# Altium schematic sheet Microcontroller_IO.SchDoc: Microcontroller_IO
size A; DrawnBy: FitC Engineers; Revision: 1; SheetNumber: 5; SheetTotal: 5
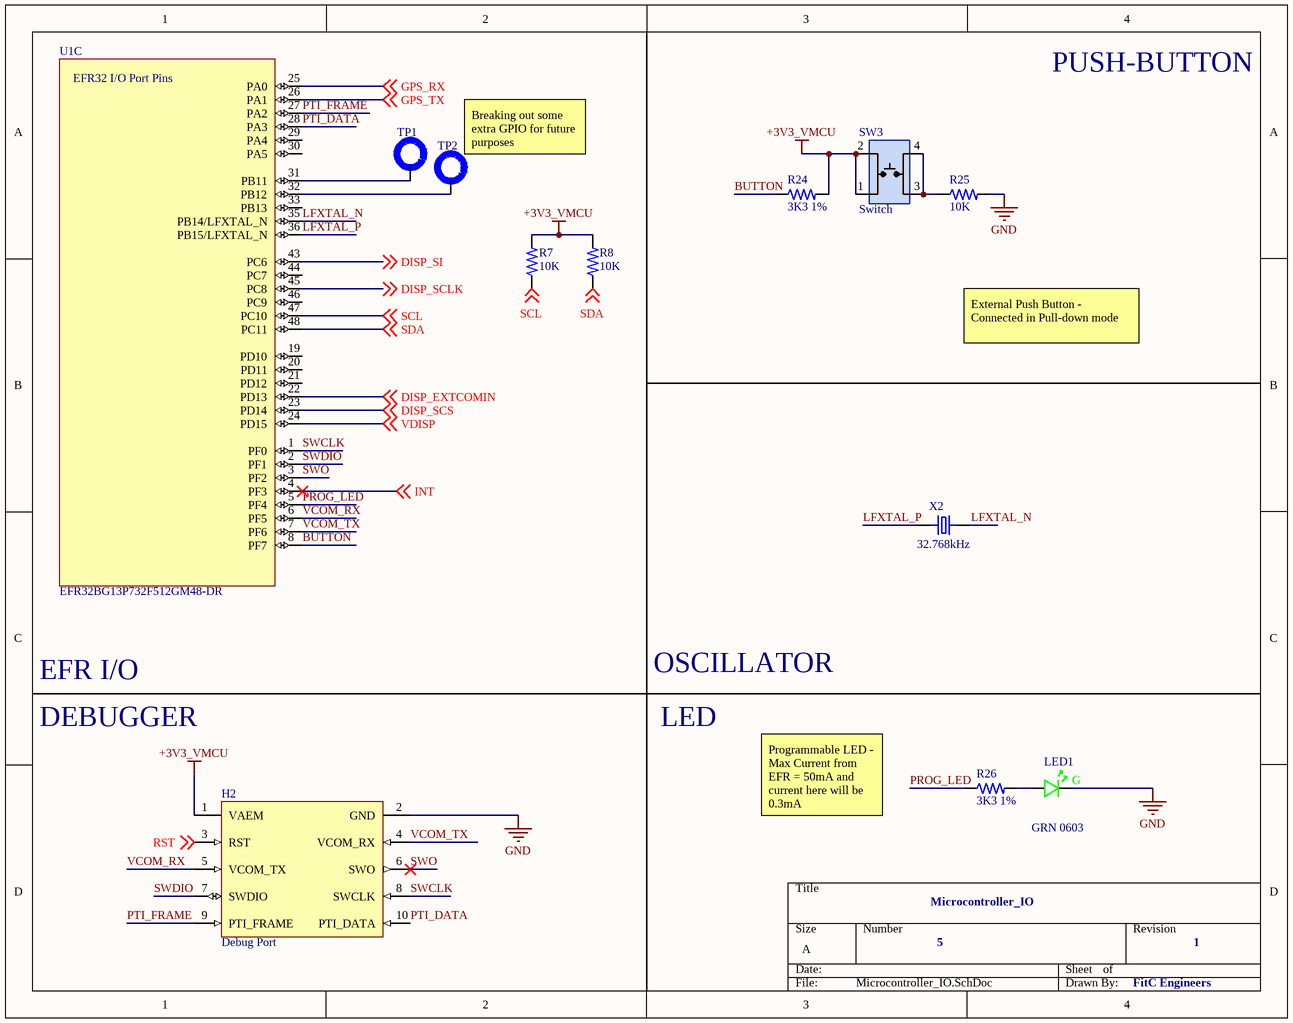
[diagram p0: Microcontroller_IO.SchDoc]

## Parts
H2  Debug Port  [Amphenol_20021121_0]
LED1  GRN 0603  [LED_0603_GRN_WL-SMCW]
R7  10K  [RES_0603_1608X06]
R8  10K  [RES_0603_1608X06]
R24  3K3 1%  [RES_0603_1608X06]
R25  10K  [RES_0603_1608X06]
R26  3K3 1%  [RES_0603_1608X06]
SW3  Switch  [SWITCH]
TP1  Test Pad for Testing  [1mm Test Pad]  (value not drawn)  (no BOM)
TP2  Test Pad for Testing  [1mm Test Pad]  (value not drawn)  (no BOM)
U1  EFR32BG13P732F512GM48-DR  [EFR32BG13_48_QFN]  (part C of 3)
X2  32.768kHz  [XTAL_ECS-.327-7-34B-TR]

## Nets
+3V3_VMCU: H2.1(VAEM) R7.2 R8.2 R24.2 SW3.1 SW3.2
GND: H2.2(GND) LED1.C R25.2
BUTTON: R24.1 U1.8(PF7)
DISP_EXTCOMIN: U1.22(PD13) ; off-sheet DISP_EXTCOMIN
DISP_SCLK: U1.45(PC8) ; off-sheet DISP_SCLK
DISP_SCS: U1.23(PD14) ; off-sheet DISP_SCS
DISP_SI: U1.43(PC6) ; off-sheet DISP_SI
GPS_RX: U1.25(PA0) ; off-sheet GPS_RX
GPS_TX: U1.26(PA1) ; off-sheet GPS_TX
INT: U1.4(PF3) ; off-sheet INT
LFXTAL_N: U1.35(PB14/LFXTAL_N) X2.2
LFXTAL_P: U1.36(PB15/LFXTAL_N) X2.1
PROG_LED: R26.1 U1.5(PF4)
PTI_DATA: H2.10(PTI_DATA) U1.28(PA3)
PTI_FRAME: H2.9(PTI_FRAME) U1.27(PA2)
RST: H2.3(RST) ; off-sheet RST
SCL: R7.1 U1.47(PC10) ; off-sheet SCL
SDA: R8.1 U1.48(PC11) ; off-sheet SDA
SWCLK: H2.8(SWCLK) U1.1(PF0)
SWDIO: H2.7(SWDIO) U1.2(PF1)
SWO: H2.6(SWO) U1.3(PF2)
VCOM_RX: H2.5(VCOM_TX) U1.6(PF5)
VCOM_TX: H2.4(VCOM_RX) U1.7(PF6)
VDISP: U1.24(PD15) ; off-sheet VDISP
NetLED1_A: LED1.A R26.2
NetR25_1: R25.1 SW3.3 SW3.4
NetTP1_1: TP1.1 U1.31(PB11)
NetTP2_1: TP2.1 U1.32(PB12)

Not connected (* = marked no-connect by the designer): U1 19(PD10) 20(PD11) 21(PD12) 29(PA4) 30(PA5) 33(PB13) 44(PC7) 46(PC9)

## Notes on the sheet
- PUSH-BUTTON
- (near TP2) Breaking out some extra GPIO for future purposes
- External Push Button - Connected in Pull-down mode
- EFR I/O
- OSCILLATOR
- DEBUGGER
- LED
- Programmable LED - Max Current from EFR = 50mA and current here will be 0.3mA
- (in symbol 150060GS75000) G
- (in symbol EFR32BG13P732F512GM48-DR, part C) EFR32 I/O Port Pins

## Library data of the parts
H2 = 20021121-00010C1LF: CONN HEADER SMD 10POS 1.27MM. Connector Header Surface Mount 10 position 0.050"; Manufacturer: Amphenol ICC / FCI; Supplier 1: Digi-Key; Manufacturer Part Number: 20021121-00010C1LF; RoHS: No; Category: Headers and Wire Housings
LED1 = 150060GS75000: LED, 0603, GREEN, 430MCD, 520NM; Manufacturer: Wurth Electronics; Dynamic Catalog: 0603 Rectangle with Flat Top Chip LEDs; 3D Model: SMCW_0603.igs / SMCW_0603.stp / SMCW_0603.wrl; Wavelength - Peak: 515nm; Voltage - Forward (Vf) (Typ): 3.2V; Current - Test: 20mA; Viewing Angle: 140°; Lens Type: Clear; Lens Style/Size: Rectangle with Flat Top, 1.1mm x 0.7mm; Other Names: 732-4971-2; Supplier 1: Digi-Key; Manufacturer Part Number: 150060GS75000; Stock 1: 34964; Pricing 1: 1=0.14, 50=0.129, 100=0.11, 500=0.095 (USD); Standard Package: 4,000; Category: Optoelectronics; Family: LED Indication - Discrete; Series: WL-SMCW; Packaging: Tape & Reel (TR); Color: Green; Wavelength - Dominant: 520nm; Millicandela Rating: 430mcd; Package / Case: 0603 (1608 Metric); Size / Dimension: 1.60mm L x 0.80mm W; Height: 0.70mm; Mounting Type: Surface Mount; Online Catalog: 0603 Rectangle with Flat Top Chip LEDs; ComponentLink1URL: https://katalog.we-online.de/led/datasheet/150060GS75000.pdf?src-supplier=Digi-Key; ComponentLink1Description: https://katalog.we-online.de/led/datasheet/150060GS75000.pdf?src-supplier=Digi-Key; ComponentLink2URL: http://www.produktinfo.conrad.com/datenblaetter/750000-774999/759427-da-01-en-CHIPLED_0603_W_KL_GRUEN_150060GS75000.pdf?src-supplier=Conrad; ComponentLink2Description: http://www.produktinfo.conrad.com/datenblaetter/750000-774999/759427-da-01-en-CHIPLED_0603_W_KL_GRUEN_150060GS75000.pdf?src-supplier=Conrad; Supplier Part Number 1: 732-4971-1-ND
R7 R8 R25 = RNCP0603FTD10K0: Res Thin Film 0603 10K Ohm 1% 1/8W ±100ppm/°C Molded SMD SMD Paper T/R; Manufacturer: Stackpole Electronics; Resistance: 10kR; Max Power Dissipation: 125mW; Supplier 1: Digi-Key; Manufacturer Part Number: RNCP0603FTD10K0; RoHS: Yes; Category: Chip SMD Resistors; Stock 1: 9; Pricing 1: 1=0.10000, 10=0.06100, 100=0.02480, 1000=0.01113, 2500=0.00966 (USD); Mount: Surface Mount; Case/Package: 0603; Case Code (Metric): 1608; Case Code (Imperial): 0603; Contact Plating: Tin,Matte; Min Operating Temperature: -55°C; Max Operating Temperature: 155°C; Packaging: Tape and Reel; Tolerance: 1%; Resistor Type: Thin Film; Number of Terminations: 2; Temperature Coefficient: 100ppm/°C; Features: Moisture Resistant,Anti-Sulfur; Series: RNCP; Length: 0.059inch; Width: 0.031inch; Height: 0.02inch; Radiation Hardening: No; Lead Free: Lead Free; RoHS Compliant: Yes; ComponentLink1URL: https://www.seielect.com/Catalog/SEI-rncp.pdf?src-supplier=Avnet; ComponentLink1Description: https://www.seielect.com/Catalog/SEI-rncp.pdf?src-supplier=Avnet; ComponentLink2URL: https://www.seielect.com/Catalog/SEI-rncp.pdf?src-supplier=Digi-Key; ComponentLink2Description: https://www.seielect.com/Catalog/SEI-rncp.pdf?src-supplier=Digi-Key; ComponentLink3URL: https://www.seielect.com/catalog/SEI-Packaging.pdf?src-supplier=Digi-Key; ComponentLink3Description: https://www.seielect.com/catalog/SEI-Packaging.pdf?src-supplier=Digi-Key; Supplier Part Number 1: RNCP0603FTD10K0CT-ND
R24 R26 = RMCF0603FT3K30: Res Thick Film 0603 3.3K Ohm 1% 0.1W(1/10W) ±100ppm/C Pad SMD Automotive T/R; Manufacturer: Stackpole Electronics; Resistance: 3.3kR; Max Power Dissipation: 100mW; Temperature Coefficient: 100ppm/°C; Supplier 1: Digi-Key; Manufacturer Part Number: RMCF0603FT3K30; RoHS: Yes; Category: Chip SMD Resistors; Stock 1: 471315; Pricing 1: 1=0.10000, 10=0.01700, 100=0.00680, 1000=0.00305, 2500=0.00264 (USD); Mount: Surface Mount; Case/Package: 0603; Case Code (Metric): 1608; Case Code (Imperial): 0603; Contact Plating: Tin,Matte; Min Operating Temperature: -55°C; Max Operating Temperature: 155°C; Packaging: Tape and Reel; Tolerance: 1%; Resistor Type: Thick Film; Number of Terminations: 2; Features: Automotive AEC-Q200; Series: RMCF; Construction: Rectangular; Length: 0.061inch; Width: 0.031inch; Height: 0.022inch; Depth: 0.8mm; Radiation Hardening: No; Military Standard: Not; RoHS Compliant: Yes; ComponentLink1URL: https://datasheet.ciiva.com/15193/getdatasheetpartid-376121-15193477.pdf?src-supplier=Verical; ComponentLink1Description: https://datasheet.ciiva.com/15193/getdatasheetpartid-376121-15193477.pdf?src-supplier=Verical; Supplier Part Number 1: RMCF0603FT3K30CT-ND
SW3 = RKB2SJM250SMTR LFS (2): Switch Tactile SPST-NO Button Gull Wing 50mA 12VDC 100000Cycle 180gf Surface Mount T/R; Manufacturer: C&K Components; Supplier 1: Digi-Key; Manufacturer Part Number: RKB2SJM250SMTR LFS; Category: Connectors; Stock 1: 5895; Pricing 1: 1=0.19000, 10=0.18600, 25=0.17640, 100=0.16050, 250=0.15088, 500=0.13804, 1000=0.11556 (USD); ComponentLink1URL: https://datasheet.octopart.com/RKB2SJM250SMTR-LFS-C%26K-Components-datasheet-151570462.pdf?src-supplier=Allied+Electronics; ComponentLink1Description: https://datasheet.octopart.com/RKB2SJM250SMTR-LFS-C%26K-Components-datasheet-151570462.pdf?src-supplier=Allied+Electronics; Supplier Part Number 1: 108-RKB2SJM250SMTRLFSCT-ND
TP1 TP2 = Test_Pad
U1 = EFR32BG13P732F512GM48-DR: Blue Gecko QFN48 2.4 G 19 dB BLE/Proprietary 512 kB 64 kB(RAM) 31GPIO; Manufacturer: Silicon Labs; Supplier 1: Digi-Key; Manufacturer Part Number: EFR32BG13P732F512GM48-DR; Category: RF Receivers, Transceivers; ComponentLink1URL: https://datasheet.octopart.com/EFR32BG13P732F512GM48-DR-Silicon-Labs-datasheet-150822224.pdf?src-supplier=Silicon+Labs; ComponentLink1Description: https://datasheet.octopart.com/EFR32BG13P732F512GM48-DR-Silicon-Labs-datasheet-150822224.pdf?src-supplier=Silicon+Labs; ComponentLink2URL: https://datasheet.octopart.com/EFR32BG13P732F512GM48-DR-Silicon-Labs-datasheet-142345357.pdf?src-supplier=Silicon+Labs+SCT; ComponentLink2Description: https://datasheet.octopart.com/EFR32BG13P732F512GM48-DR-Silicon-Labs-datasheet-142345357.pdf?src-supplier=Silicon+Labs+SCT; ComponentLink3URL: https://datasheet.octopart.com/EFR32BG13P732F512GM48-DR-Silicon-Labs-datasheet-150822225.pdf?src-supplier=Farnell; ComponentLink3Description: https://datasheet.octopart.com/EFR32BG13P732F512GM48-DR-Silicon-Labs-datasheet-150822225.pdf?src-supplier=Farnell; Supplier Part Number 1: EFR32BG13P732F512GM48-DR-ND
X2 = ECS-.327-7-34B-TR: 32.768kHz Â±20ppm Crystal 7pF 70 kOhms 2-SMD, No Lead; MF: ECS Inc.; Availability: Unavailable; MP: ECS-.327-7-34B-TR; Price: None; Value: *; SnapEDA_Link: https://www.snapeda.com/parts/ECS-.327-7-34B-TR/ECS%20Inc./view-part/55054/?ref=snap; Package: SMD-2 ECS International